# Altium project MotorBoard.PrjPcb
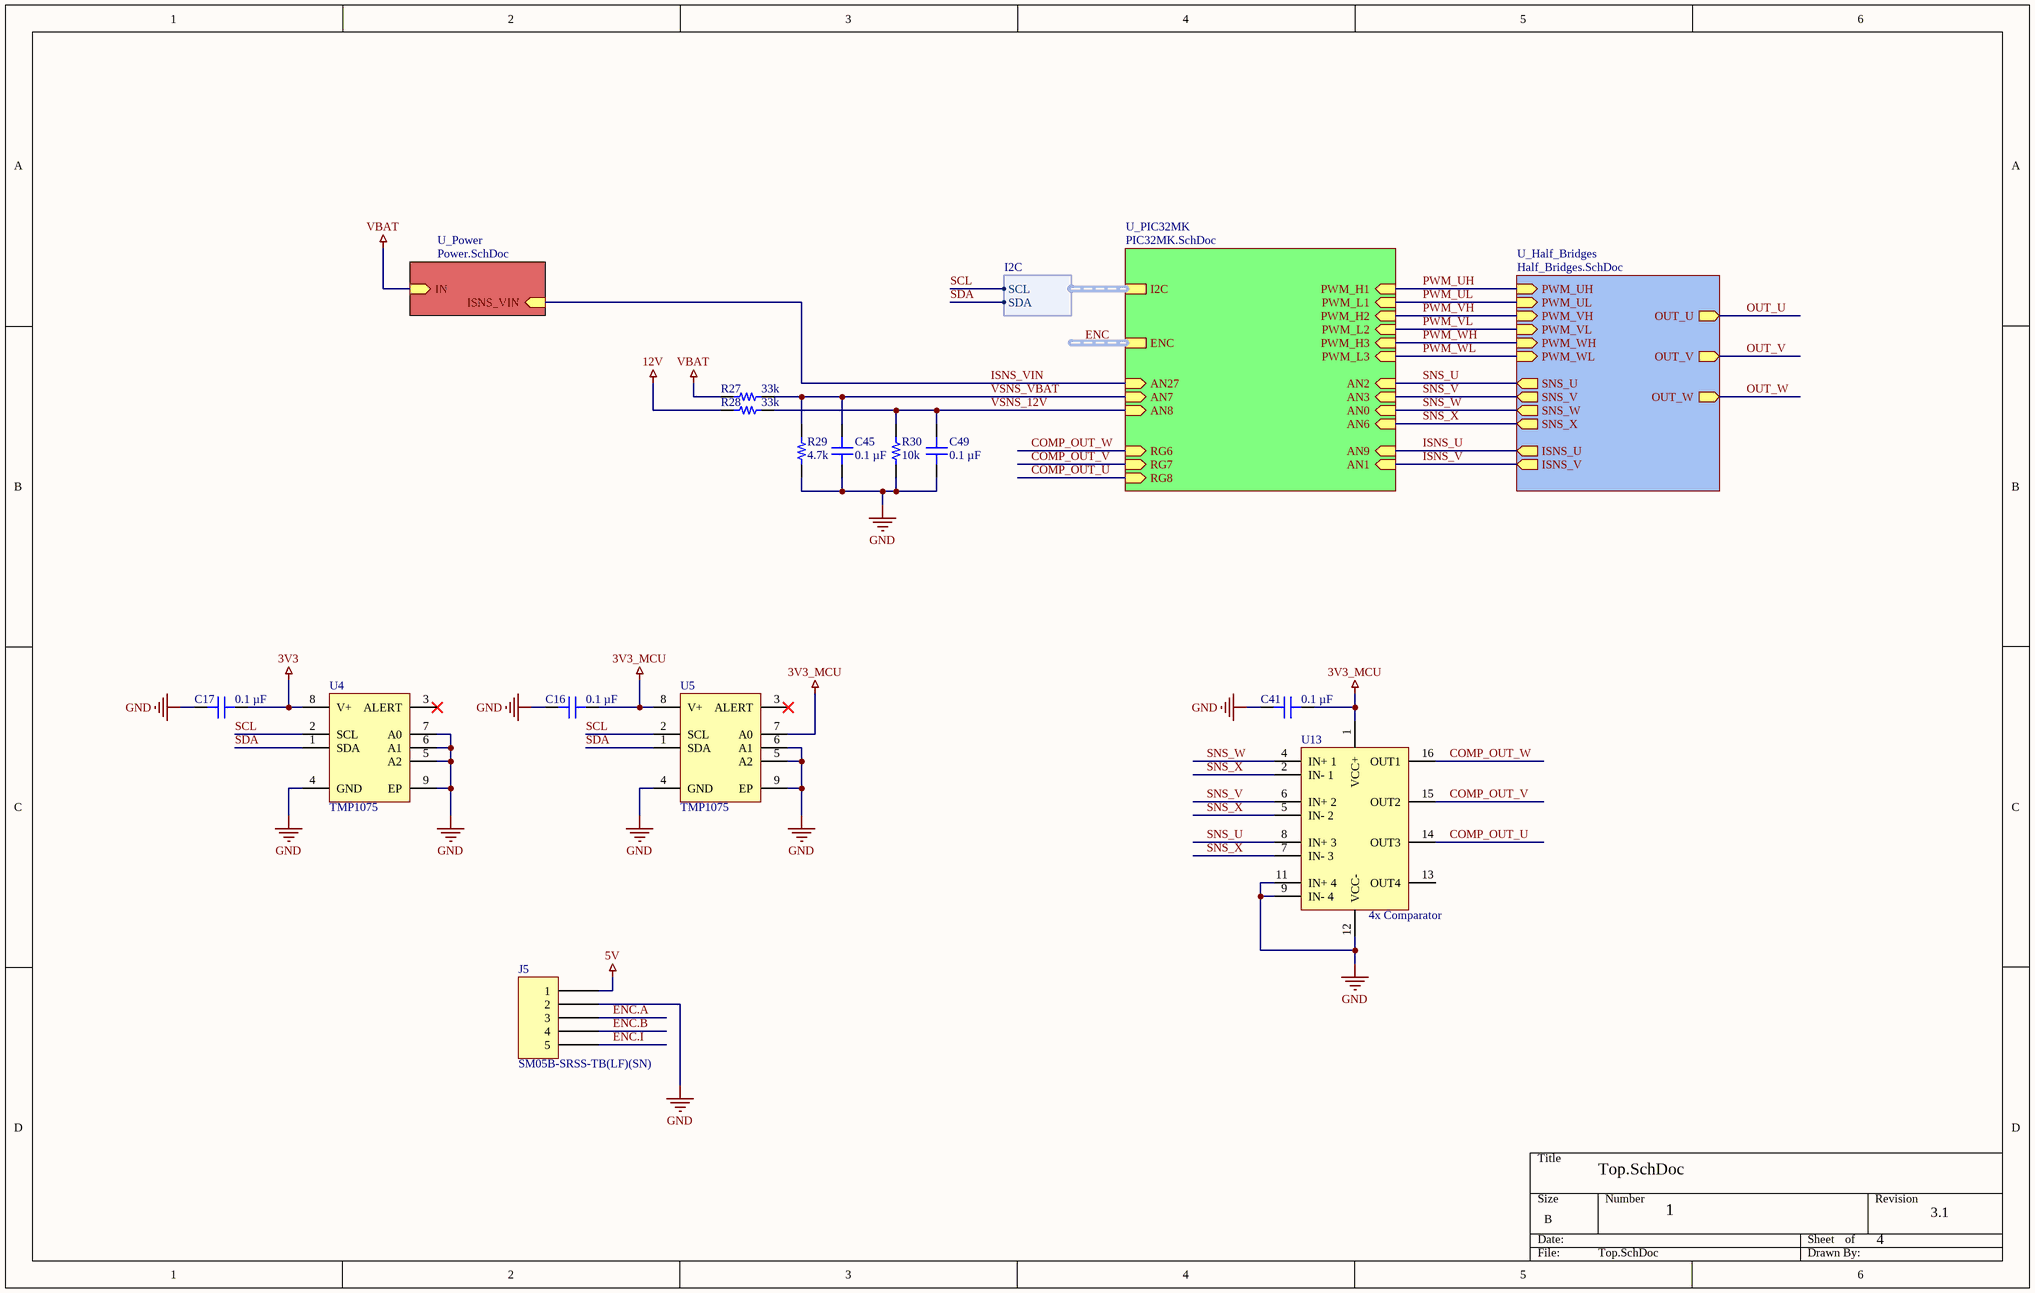
[diagram p0: Top.SchDoc]
Project: Cubli; ProjectRevision: 3.1
4 sheets, 119 parts. Net scope: hierarchical (ports join the sheet entries above them; power ports are global).
Board file: MotorBoard.PcbDoc
Sheets:
  Top.SchDoc
    U_PIC32MK = PIC32MK.SchDoc
    U_Power = Power.SchDoc
    U_Half_Bridges = Half_Bridges.SchDoc

## Sheet Top.SchDoc
size B; DocumentNumber: 5; Revision: 1.1; SheetNumber: 1; SheetTotal: 4

### Parts
C16  0.1 µF  [CAP 0402_1005]
C17  0.1 µF  [CAP 0402_1005]
C41  0.1 µF  [CAP 0402_1005]
C45  0.1 µF  [CAP 0402_1005]
C49  0.1 µF  [CAP 0402_1005]
J5  SM05B-SRSS-TB(LF)(SN)  [JST SM05B-SRSS-TB]
R27  33k  [RES 0402_1005]
R28  33k  [RES 0402_1005]
R29  4.7k  [RES 0402_1005]
R30  10k  [RES 0402_1005]
U4  TMP1075  [8_WSON_2x2_0.5mm]
U5  TMP1075  [8_WSON_2x2_0.5mm]
U13  4x Comparator  [QFN50P300X300X100-16N]

### Sub-sheets
U_Half_Bridges = Half_Bridges.SchDoc: PWM_UH (in), PWM_UL (in), PWM_VH (in), PWM_VL (in), PWM_WH (in), PWM_WL (in), SNS_U (out), SNS_V (out), SNS_W (out), SNS_X (out), OUT_U (out), OUT_V (out), OUT_W (out), ISNS_U (out), ISNS_V (out)
U_PIC32MK = PIC32MK.SchDoc: I2C (harness I2C), PWM_L1 (in), PWM_H1 (in), PWM_L2 (in), PWM_H2 (in), PWM_L3 (in), PWM_H3 (in), ENC (harness ENC), AN9 (in), AN1 (in), AN6 (in), AN2 (in), AN3 (in), AN0 (in), RG6 (in), RG7 (in), RG8 (in), AN7 (in), AN8 (in), AN27 (in)
U_Power = Power.SchDoc: IN (in), ISNS_VIN (in)

### Harnesses
I2C: SCL, SDA

### Nets
3V3: C17.2 U4.8(V+)
3V3_MCU: C16.2 C41.2 U5.7(A0) U5.8(V+) U13.1(VCC+)
5V: J5.1
12V: R28.2
GND: C16.1 C17.1 C41.1 C45.1 C49.1 J5.2 R29.2 R30.2 U4.4(GND) U4.5(A2) U4.6(A1) U4.7(A0) U4.9(EP) U5.4(GND) U5.5(A2) U5.6(A1) U5.9(EP) U13.9(IN-_4) U13.11(IN+_4) U13.12(VCC-)
VBAT: R27.2 ; sheet U_Power/IN
COMP_OUT_U: U13.14(OUT3) ; sheet U_PIC32MK/RG8
COMP_OUT_V: U13.15(OUT2) ; sheet U_PIC32MK/RG7
COMP_OUT_W: U13.16(OUT1) ; sheet U_PIC32MK/RG6
ENC.A: J5.3
ENC.B: J5.4
ENC.I: J5.5
ISNS_U: sheet U_PIC32MK/AN9, sheet U_Half_Bridges/ISNS_U
ISNS_V: sheet U_PIC32MK/AN1, sheet U_Half_Bridges/ISNS_V
ISNS_VIN: sheet U_PIC32MK/AN27, sheet U_Power/ISNS_VIN
PWM_UH: sheet U_PIC32MK/PWM_H1, sheet U_Half_Bridges/PWM_UH
PWM_UL: sheet U_PIC32MK/PWM_L1, sheet U_Half_Bridges/PWM_UL
PWM_VH: sheet U_PIC32MK/PWM_H2, sheet U_Half_Bridges/PWM_VH
PWM_VL: sheet U_PIC32MK/PWM_L2, sheet U_Half_Bridges/PWM_VL
PWM_WH: sheet U_PIC32MK/PWM_H3, sheet U_Half_Bridges/PWM_WH
PWM_WL: sheet U_PIC32MK/PWM_L3, sheet U_Half_Bridges/PWM_WL
SCL: U4.2(SCL) U5.2(SCL) ; sheet U_PIC32MK/I2C.SCL
SDA: U4.1(SDA) U5.1(SDA) ; sheet U_PIC32MK/I2C.SDA
SNS_U: U13.8(IN+_3) ; sheet U_PIC32MK/AN2, sheet U_Half_Bridges/SNS_U
SNS_V: U13.6(IN+_2) ; sheet U_PIC32MK/AN3, sheet U_Half_Bridges/SNS_V
SNS_W: U13.4(IN+_1) ; sheet U_PIC32MK/AN0, sheet U_Half_Bridges/SNS_W
SNS_X: U13.2(IN-_1) U13.5(IN-_2) U13.7(IN-_3) ; sheet U_PIC32MK/AN6, sheet U_Half_Bridges/SNS_X
VSNS_12V: C49.2 R28.1 R30.1 ; sheet U_PIC32MK/AN8
VSNS_VBAT: C45.2 R27.1 R29.1 ; sheet U_PIC32MK/AN7

Not connected (* = marked no-connect by the designer): U4 3(ALERT)*; U5 3(ALERT)*; U13 13(OUT4)

### Buses and harness runs
harness ENC = sheet U_PIC32MK/ENC

### Library data of the parts
C16 C17 C41 C45 C49 = C0402C104K4RACAUTO: CAP CER 0.1UF 16V X7R 0402; manufacturer: KEMET; Tolerance: ±10%; Part Number: C0402C104K4RACAUTO; Value: 0.1 µF; Applications: Automotive, Bypass, Decoupling; Capacitance: 0.1 µF; componentlink1description: Datasheet; componentlink1url: https://api.kemet.com/component-edge/download/specsheet/C0402C104K4RACAUTO.pdf; componentlink2description: DigiKey Link; componentlink2url: https://www.digikey.com/en/products/detail/kemet/C0402C104K4RACAUTO/3314827; Device Package: 0402 (1005 Metric); lastupdated: 8/14/2022 9:05:51 PM; Lifecycle Status: Active; Minimum Order: 1; Mounting Type: Surface Mount, MLCC; Operating Temperature: -55°C ~ 125°C; Package / Case: 0402 (1005 Metric); packaging: TapeAndReel; partid: 3024; Part Status: Active; price: 0.01; Ratings: AEC-Q200; series: SMD Auto X7R; Size / Dimension: 0.039" L x 0.020" W (1.00mm x 0.50mm); Supplier 1: DigiKey; Supplier Part Number 1: 399-6828-1-ND; Temperature Coefficient: X7R; Thickness (Max): 0.022" (0.55mm); Voltage - Rated: 16V
J5 = SM05B-SRSS-TB(LF)(SN): CONN HEADER SMD R/A 5POS 1MM; Manufacturer: JST Sales America Inc.; Current Rating (Amps): 0.7A; Material Flammability Rating: UL94 V-0; Number of Positions: 5; Number of Positions Loaded: All; Pitch - Mating: 0.039" (1.00mm); Shrouding: Shrouded - 4 Wall; Style: Board to Cable/Wire; Voltage Rating: 50V; Part Number: SM05B-SRSS-TB(LF)(SN); ComponentLink1Description: Datasheet; ComponentLink1URL: http://www.jst-mfg.com/product/pdf/eng/eSH.pdf; ComponentLink2Description: DigiKey Link; ComponentLink2URL: http://digikey.com/product-detail/en/jst-sales-america-inc/SM05B-SRSS-TB-LF-SN/455-1805-1-ND/926876; Connector Type: Header; Contact Finish - Mating: Tin; Contact Finish - Post: Tin; Contact Material: Copper Alloy; Contact Shape: Square; Contact Type: Male Pin; Fastening Type: Push-Pull; Features: Solder Retention; Insulation Color: Natural; Insulation Height: 0.114" (2.90mm); Insulation Material: Polyamide (PA), Nylon; LastUpdated: 1/12/2020 11:42:04 PM; Lifecycle Status: Active; Minimum Order: 1; Mounting Type: Surface Mount, Right Angle; Number of Rows: 1; Operating Temperature: -25°C ~ 85°C; Packaging: TapeAndReel; PartId: 63; Part Status: Active; Price: 0.32; Series: SR; Supplier 1: DigiKey; Supplier Part Number 1: 455-1805-1-ND; Termination: Solder
R27-R30 = RK73H1ETTP1432F: RES 14.3K OHM 1% 1/10W 0402; Manufacturer: KOA Speer Electronics, Inc.; Power (Watts): 0.1W, 1/10W; Resistance: 14.3 kOhms; Temperature Coefficient: ±100ppm/°C; Part Number: RK73H1ETTP1432F; ComponentLink1Description: Datasheet; ComponentLink1URL: http://www.koaspeer.com/catimages/Products/RK73H/RK73H.pdf; ComponentLink2Description: DigiKey Link; ComponentLink2URL: https://www.digikey.com/en/products/detail/koa-speer-electronics-inc/RK73H1ETTP1432F/9844351; Composition: Thick Film; Device Package: 0402 (1005 Metric); Features: Automotive AEC-Q200, Moisture Resistant; Height - Seated (Max): 0.016" (0.40mm); LastUpdated: 8/14/2022 9:23:49 PM; Lifecycle Status: Active; Minimum Order: 1; Number of Terminations: 2; Operating Temperature: -55°C ~ 155°C; Package / Case: 0402 (1005 Metric); Packaging: CutTape; PartId: 10193; Part Status: Active; Price: 0.01; Ratings: AEC-Q200; Series: RK73H; Size / Dimension: 0.039" L x 0.020" W (1.00mm x 0.50mm); Supplier 1: DigiKey; Supplier Part Number 1: 2019-RK73H1ETTP1432FCT-ND; Supplier Device Package: 0402; Tolerance: ±1%
  R27 R28: Value: 33k
  R29: Value: 4.7k
  R30: Value: 10k
U4 U5 = TMP1075: I2C TEMP SENSOR
U13 = LM2901Q4T: Comparator General Purpose CMOS, DTL, MOS, Open-Collector, TTL 16-QFN (3x3)

## Sheet PIC32MK.SchDoc
size B; DocumentNumber: 3; SheetNumber: 2; SheetTotal: 4
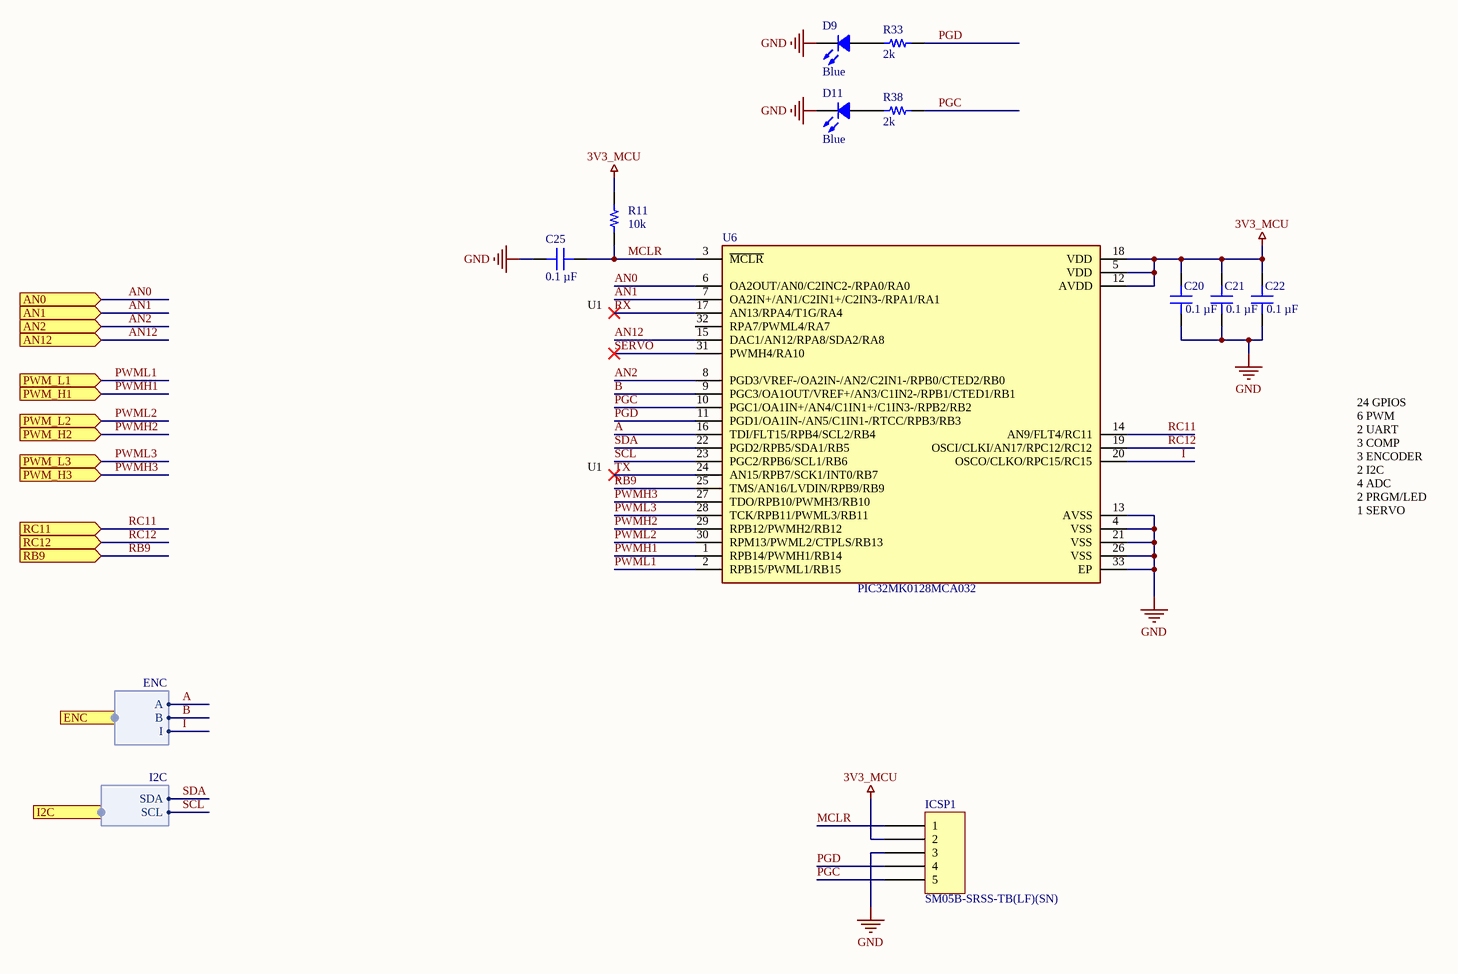
[diagram p1: PIC32MK.SchDoc]

### Parts
C20  0.1 µF  [CAP 0402_1005]
C21  0.1 µF  [CAP 0402_1005]
C22  0.1 µF  [CAP 0402_1005]
C25  0.1 µF  [CAP 0402_1005]
D9  Blue  [LED 0603_1608 GREEN]
D11  Blue  [LED 0603_1608 GREEN]
ICSP1  SM05B-SRSS-TB(LF)(SN)  [JST SM05B-SRSS-TB]
R11  10k  [RES 0402_1005]
R33  2k  [RES 0402_1005]
R38  2k  [RES 0402_1005]
U6  PIC32MK0128MCA032  [32-QFN_5x5_PIC32]

### Ports
AN0 (in), AN1 (in), AN2 (in), AN12 (in), ENC (harness ENC), I2C (harness I2C), PWM_H1 (in), PWM_H2 (in), PWM_H3 (in), PWM_L1 (in), PWM_L2 (in), PWM_L3 (in), RB9 (in), RC11 (in), RC12 (in)

### Harnesses
I2C: SDA, SCL
ENC: A, B, I

### Nets
3V3_MCU: C20.2 C21.2 C22.2 ICSP1.2 R11.2 U6.5(VDD) U6.12(AVDD) U6.18(VDD)
GND: C20.1 C21.1 C22.1 C25.2 D9.2 D11.2 ICSP1.3 U6.4(VSS) U6.13(AVSS) U6.21(VSS) U6.26(VSS) U6.33(EP)
A: U6.16(TDI/FLT15/RPB4/SCL2/RB4) ; port ENC.A  [project net ENC.A]
AN0: U6.6(OA2OUT/AN0/C2INC2-/RPA0/RA0) ; port AN0  [project net SNS_W]
AN1: U6.7(OA2IN+/AN1/C2IN1+/C2IN3-/RPA1/RA1) ; port AN1  [project net ISNS_V]
AN2: U6.8(PGD3/VREF-/OA2IN-/AN2/C2IN1-/RPB0/CTED2/RB0) ; port AN2  [project net SNS_U]
AN12: U6.15(DAC1/AN12/RPA8/SDA2/RA8) ; port AN12
B: U6.9(PGC3/OA1OUT/VREF+/AN3/C1IN2-/RPB1/CTED1/RB1) ; port ENC.B  [project net ENC.B]
I: U6.20(OSCO/CLKO/RPC15/RC15) ; port ENC.I  [project net ENC.I]
MCLR: C25.1 ICSP1.1 R11.1 U6.3(~{MCLR})
PGC: ICSP1.5 R38.1 U6.10(PGC1/OA1IN+/AN4/C1IN1+/C1IN3-/RPB2/RB2)
PGD: ICSP1.4 R33.1 U6.11(PGD1/OA1IN-/AN5/C1IN1-/RTCC/RPB3/RB3)
PWMH1: U6.1(RPB14/PWMH1/RB14) ; port PWM_H1  [project net PWM_UH]
PWMH2: U6.29(RPB12/PWMH2/RB12) ; port PWM_H2  [project net PWM_VH]
PWMH3: U6.27(TDO/RPB10/PWMH3/RB10) ; port PWM_H3  [project net PWM_WH]
PWML1: U6.2(RPB15/PWML1/RB15) ; port PWM_L1  [project net PWM_UL]
PWML2: U6.30(RPM13/PWML2/CTPLS/RB13) ; port PWM_L2  [project net PWM_VL]
PWML3: U6.28(TCK/RPB11/PWML3/RB11) ; port PWM_L3  [project net PWM_WL]
RB9: U6.25(TMS/AN16/LVDIN/RPB9/RB9) ; port RB9
RC11: U6.14(AN9/FLT4/RC11) ; port RC11
RC12: U6.19(OSCI/CLKI/AN17/RPC12/RC12) ; port RC12
RX: U6.17(AN13/RPA4/T1G/RA4)
SCL: U6.23(PGC2/RPB6/SCL1/RB6) ; port I2C.SCL
SDA: U6.22(PGD2/RPB5/SDA1/RB5) ; port I2C.SDA
SERVO: U6.31(PWMH4/RA10)
TX: U6.24(AN15/RPB7/SCK1/INT0/RB7)
NetD9_1: D9.1 R33.2
NetD11_1: D11.1 R38.2

Not connected (* = marked no-connect by the designer): U6 32(RPA7/PWML4/RA7)

### Notes on the sheet
- (near C25) U1
- U1
- 24 GPIOS
  6 PWM
  2 UART
  3 COMP
  3 ENCODER
  2 I2C
  4 ADC
  2 PRGM/LED
  1 SERVO

### Library data of the parts
C20-C22 C25 = C0402C104K4RACAUTO: as C16 on sheet Top; Part Number: C0402C104K4RACAUTO; Value: 0.1 µF; Applications: Automotive, Bypass, Decoupling; Capacitance: 0.1 µF; componentlink1description: Datasheet; componentlink1url: https://api.kemet.com/component-edge/download/specsheet/C0402C104K4RACAUTO.pdf; componentlink2description: DigiKey Link; componentlink2url: https://www.digikey.com/en/products/detail/kemet/C0402C104K4RACAUTO/3314827; Device Package: 0402 (1005 Metric); lastupdated: 8/14/2022 9:05:51 PM; Lifecycle Status: Active; Minimum Order: 1; Mounting Type: Surface Mount, MLCC; Operating Temperature: -55°C ~ 125°C; Package / Case: 0402 (1005 Metric); packaging: TapeAndReel; partid: 3024; Part Status: Active; price: 0.01; Ratings: AEC-Q200; series: SMD Auto X7R; Size / Dimension: 0.039" L x 0.020" W (1.00mm x 0.50mm); Supplier 1: DigiKey; Supplier Part Number 1: 399-6828-1-ND; Temperature Coefficient: X7R; Thickness (Max): 0.022" (0.55mm); Voltage - Rated: 16V
D9 D11 = XZCDGK53W-8VF: Blue LED; Manufacturer: SunLED; Color: Green; Configuration: Independent; Current - Test: 2mA; Lens Color: Colorless; Lens Size: 0.35mm Dia; Lens Style: Round with Domed Top; Lens Transparency: Clear; Millicandela Rating: 417mcd; Value: Green; Viewing Angle: 60°; Voltage - Forward (Vf) (Typ): 2.65V; Wavelength - Dominant: 525nm; Wavelength - Peak: 515nm; Part Number: XZCDGK53W-8VF; ComponentLink1Description: Datasheet; ComponentLink1URL: https://www.sunledusa.com/products/spec/XZCDGK53W-8VF.pdf; ComponentLink2Description: DigiKey Link; ComponentLink2URL: http://digikey.com/product-detail/en/sunled/XZCDGK53W-8VF/1497-XZCDGK53W-8VFCT-ND/10449792; Device Package: 0603 (1608 Metric); Height (Max): 1.10mm; LastUpdated: 21-Jan-20 3:12:09 AM; Lifecycle Status: Active; Minimum Order: 1; Mounting Type: Surface Mount; Package / Case: 0603 (1608 Metric); Packaging: Unknown; PartId: 938; Part Status: Active; Price: 0.18; Series: Ultra Low Current; Size / Dimension: 1.60mm L x 0.80mm W; Supplier 1: DigiKey; Supplier Part Number 1: 1497-XZCDGK53W-8VFCT-ND; Supplier Device Package: 2-SMD
ICSP1 = SM05B-SRSS-TB(LF)(SN): as J5 on sheet Top; Part Number: SM05B-SRSS-TB(LF)(SN); ComponentLink1Description: Datasheet; ComponentLink1URL: http://www.jst-mfg.com/product/pdf/eng/eSH.pdf; ComponentLink2Description: DigiKey Link; ComponentLink2URL: http://digikey.com/product-detail/en/jst-sales-america-inc/SM05B-SRSS-TB-LF-SN/455-1805-1-ND/926876; Connector Type: Header; Contact Finish - Mating: Tin; Contact Finish - Post: Tin; Contact Material: Copper Alloy; Contact Shape: Square; Contact Type: Male Pin; Fastening Type: Push-Pull; Features: Solder Retention; Insulation Color: Natural; Insulation Height: 0.114" (2.90mm); Insulation Material: Polyamide (PA), Nylon; LastUpdated: 1/12/2020 11:42:04 PM; Lifecycle Status: Active; Minimum Order: 1; Mounting Type: Surface Mount, Right Angle; Number of Rows: 1; Operating Temperature: -25°C ~ 85°C; Packaging: TapeAndReel; PartId: 63; Part Status: Active; Price: 0.32; Series: SR; Supplier 1: DigiKey; Supplier Part Number 1: 455-1805-1-ND; Termination: Solder
R11 R33 R38 = RK73H1ETTP1432F: as R27 on sheet Top; Part Number: RK73H1ETTP1432F; ComponentLink1Description: Datasheet; ComponentLink1URL: http://www.koaspeer.com/catimages/Products/RK73H/RK73H.pdf; ComponentLink2Description: DigiKey Link; ComponentLink2URL: https://www.digikey.com/en/products/detail/koa-speer-electronics-inc/RK73H1ETTP1432F/9844351; Composition: Thick Film; Device Package: 0402 (1005 Metric); Features: Automotive AEC-Q200, Moisture Resistant; Height - Seated (Max): 0.016" (0.40mm); LastUpdated: 8/14/2022 9:23:49 PM; Lifecycle Status: Active; Minimum Order: 1; Number of Terminations: 2; Operating Temperature: -55°C ~ 155°C; Package / Case: 0402 (1005 Metric); Packaging: CutTape; PartId: 10193; Part Status: Active; Price: 0.01; Ratings: AEC-Q200; Series: RK73H; Size / Dimension: 0.039" L x 0.020" W (1.00mm x 0.50mm); Supplier 1: DigiKey; Supplier Part Number 1: 2019-RK73H1ETTP1432FCT-ND; Supplier Device Package: 0402; Tolerance: ±1%
  R11: Value: 10k
  R33 R38: Value: 2k
U6 = PIC32MK0128MCA032: PIC32MK Microcontroller IC 32-Bit 120MHz 1MB _1M x 8_ FLASH 32-VQFN_5x5_; MP: PIC32MK1024MCF064-I/PT; MF: Microchip; Digi-Key_Purchase_URL: https://www.digikey.kr/product-detail/en/microchip-technology/PIC32MK1024MCF064-I-PT/PIC32MK1024MCF064-I-PT-ND/7164902?utm_source=snapeda&utm_medium=aggregator&utm_campaign=symbol; Package: TQFP-64 Microchip; Digi-Key_Part_Number: PIC32MK1024MCF064-I/PT-ND; Value: *; SnapEDA_Link: https://www.snapeda.com/parts/PIC32MK1024MCF064-I/PT/Microchip/view-part/876704/?ref=snap

## Sheet Power.SchDoc
size B; DocumentNumber: 4; SheetNumber: 3; SheetTotal: 4
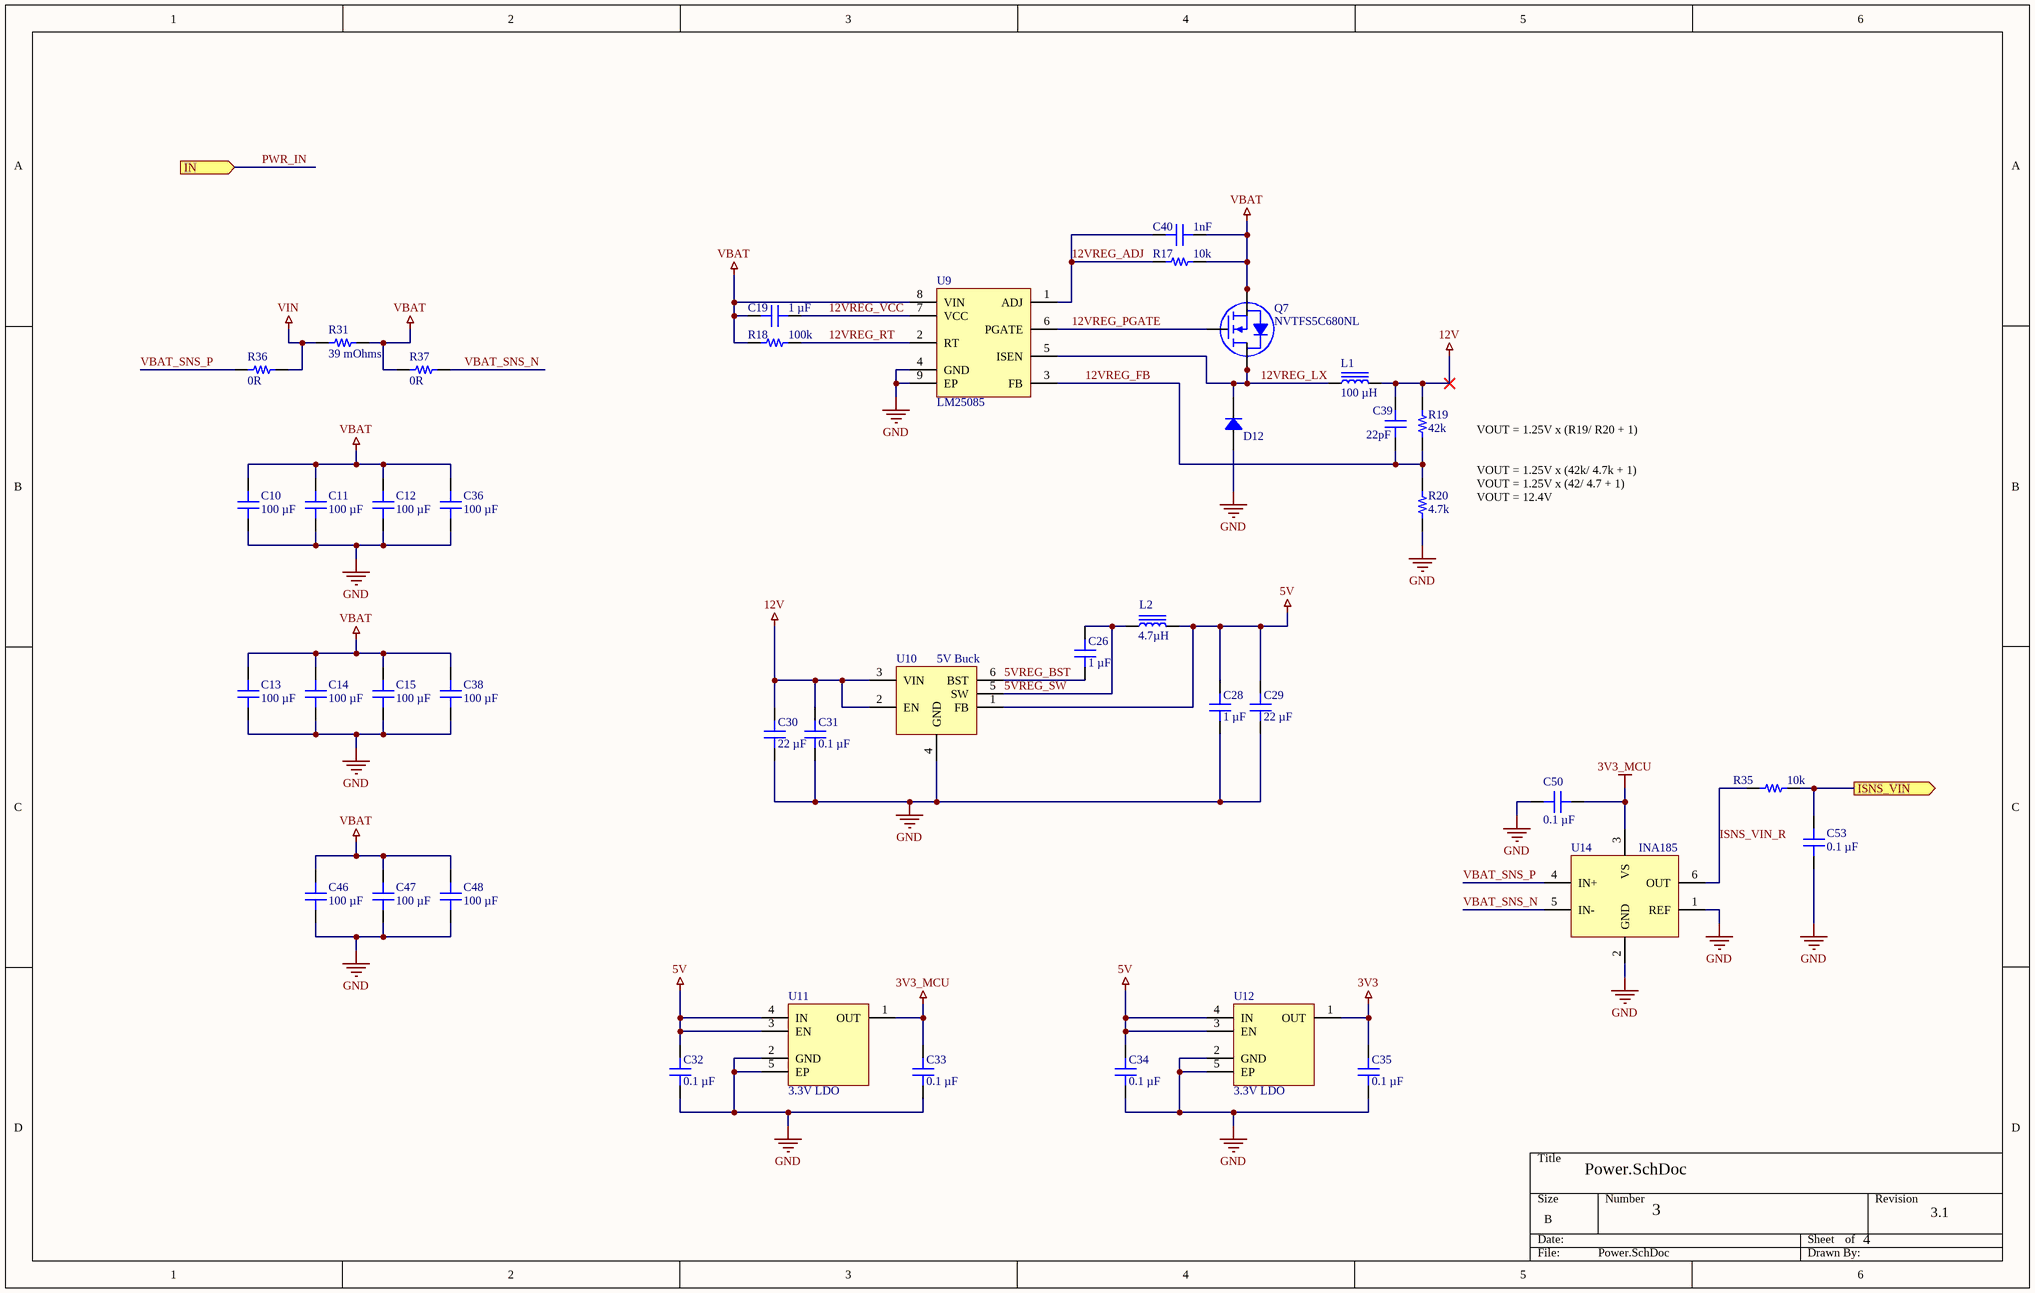
[diagram p2: Power.SchDoc]

### Parts
C10  100 µF  [CAP 1210_3225 - 1MM]
C11  100 µF  [CAP 1210_3225 - 1MM]
C12  100 µF  [CAP 1210_3225 - 1MM]
C13  100 µF  [CAP 1210_3225 - 1MM]
C14  100 µF  [CAP 1210_3225 - 1MM]
C15  100 µF  [CAP 1210_3225 - 1MM]
C19  1 µF  [CAP 0402_1005]
C26  1 µF  [CAP 0402_1005]
C28  1 µF  [CAP 0402_1005]
C29  22 µF  [CAP 0402_1005]
C30  22 µF  [CAP 0603_1608]
C31  0.1 µF  [CAP 0402_1005]
C32  0.1 µF  [CAP 0402_1005]
C33  0.1 µF  [CAP 0402_1005]
C34  0.1 µF  [CAP 0402_1005]
C35  0.1 µF  [CAP 0402_1005]
C36  100 µF  [CAP 1210_3225 - 1MM]
C38  100 µF  [CAP 1210_3225 - 1MM]
C39  22pF  [CAP 0402_1005]
C40  1nF  [CAP 0402_1005]
C46  100 µF  [CAP 1210_3225 - 1MM]
C47  100 µF  [CAP 1210_3225 - 1MM]
C48  100 µF  [CAP 1210_3225 - 1MM]
C50  0.1 µF  [CAP 0402_1005]
C53  0.1 µF  [CAP 0402_1005]
D12  SE10FGHM3/H  [SMF DO-219AB]  (value not drawn)
L1  100 µH  [TDK VLCF4028-2]
L2  4.7µH  [IND 1008_2520]
Q7  NVTFS5C680NL  [NVTFS015N04CTAG]
R17  10k  [RES 0402_1005]
R18  100k  [RES 0402_1005]
R19  42k  [RES 0402_1005]
R20  4.7k  [RES 0402_1005]
R31  39 mOhms  [RES 1206_3216]
R35  10k  [RES 0402_1005]
R36  0R  [RES 0201_0603]
R37  0R  [RES 0201_0603]
U9  LM25085  [8_WSON_3x3_0.5mm]
U10  5V Buck  [TSOT-26-6 - 3.2mm]
U11  3.3V LDO  [XDFN-4]
U12  3.3V LDO  [XDFN-4]
U14  INA185  [TI SC70-6 DCK]

### Ports
IN (in), ISNS_VIN (out)

### Nets
3V3: C35.2 U12.1(OUT)
3V3_MCU: C33.2 C50.1 U11.1(OUT) U14.3(VS)
5V: C28.2 C29.2 C32.2 C34.2 L2.2 U10.1(FB) U11.3(EN) U11.4(IN) U12.3(EN) U12.4(IN)
12V: C30.2 C31.2 C39.2 L1.2 R19.2 U10.2(EN) U10.3(VIN)
GND: C10.1 C11.1 C12.1 C13.1 C14.1 C15.1 C28.1 C29.1 C30.1 C31.1 C32.1 C33.1 C34.1 C35.1 C36.1 C38.1 C46.1 C47.1 C48.1 C50.2 C53.2 D12.1 R20.1 U9.4(GND) U9.9(EP) U10.4(GND) U11.2(GND) U11.5(EP) U12.2(GND) U12.5(EP) U14.1(REF) U14.2(GND)
VBAT: C10.2 C11.2 C12.2 C13.2 C14.2 C15.2 C19.1 C36.2 C38.2 C40.2 C46.2 C47.2 C48.2 Q7.1(S) Q7.2(S) Q7.3(S) R17.2 R18.1 R31.2 R37.1 U9.8(VIN) ; port IN  [also labelled PWR_IN]
VIN: R31.1 R36.2
5VREG_BST: C26.1 U10.6(BST)
5VREG_SW: C26.2 L2.1 U10.5(SW)
12VREG_ADJ: C40.1 R17.1 U9.1(ADJ)
12VREG_FB: C39.1 R19.1 R20.2 U9.3(FB)
12VREG_LX: D12.2 L1.1 Q7.5(D) Q7.6(D) Q7.7(D) Q7.8(D) U9.5(ISEN)
12VREG_PGATE: Q7.4(G) U9.6(PGATE)
12VREG_RT: R18.2 U9.2(RT)
12VREG_VCC: C19.2 U9.7(VCC)
ISNS_VIN: C53.1 R35.2 ; port ISNS_VIN
ISNS_VIN_R: R35.1 U14.6(OUT)
VBAT_SNS_N: R37.2 U14.5(IN-)
VBAT_SNS_P: R36.1 U14.4(IN+)

### Notes on the sheet
- VOUT = 1.25V x (R19/ R20 + 1)
- VOUT = 1.25V x (42k/ 4.7k + 1)
  VOUT = 1.25V x (42/ 4.7 + 1)
  VOUT = 12.4V

### Library data of the parts
C10-C15 C36 C38 C46-C48 = MSASE32MAB5107MPNA01: CAP CER 100UF 16V X5R 1210; manufacturer: Taiyo Yuden; Tolerance: ±20%; Part Number: MSASE32MAB5107MPNA01; Value: 100 µF; Applications: SMPS Filtering; Capacitance: 100 µF; componentlink1description: Datasheet; componentlink1url: https://mm.digikey.com/Volume0/opasdata/d220001/medias/docus/5731/MSR01_e.pdf; componentlink2description: DigiKey Link; componentlink2url: https://www.digikey.com/en/products/detail/taiyo-yuden/MSASE32MAB5107MPNA01/16664685; Device Package: 1210 (3225 Metric); lastupdated: 6/4/2024 7:20:42 PM; Lifecycle Status: Active; Minimum Order: 1; Mounting Type: Surface Mount, MLCC; Operating Temperature: -55°C ~ 85°C; Package / Case: 1210 (3225 Metric); packaging: TapeAndReel; partid: 58478; price: 0.66; series: MSAS; Size / Dimension: 0.126" L x 0.098" W (3.20mm x 2.50mm); Supplier 1: DigiKey; Supplier Part Number 1: 587-MSASE32MAB5107MPNA01CT-ND; Temperature Coefficient: X5R; Thickness (Max): 0.110" (2.80mm); Voltage - Rated: 16V
C19 C26 C28 C29 C39 C40 = C0402C104K4RACAUTO: CAP CER 0.1UF 16V X7R 0402; manufacturer: KEMET; Capacitance: 0.1 µF; Tolerance: ±10%; Part Number: C0402C104K4RACAUTO; Applications: Automotive, Bypass, Decoupling; componentlink1description: Datasheet; componentlink1url: https://api.kemet.com/component-edge/download/specsheet/C0402C104K4RACAUTO.pdf; componentlink2description: DigiKey Link; componentlink2url: https://www.digikey.com/en/products/detail/kemet/C0402C104K4RACAUTO/3314827; Device Package: 0402 (1005 Metric); lastupdated: 8/14/2022 9:05:51 PM; Lifecycle Status: Active; Minimum Order: 1; Mounting Type: Surface Mount, MLCC; Operating Temperature: -55°C ~ 125°C; Package / Case: 0402 (1005 Metric); packaging: TapeAndReel; partid: 3024; Part Status: Active; price: 0.01; Ratings: AEC-Q200; series: SMD Auto X7R; Size / Dimension: 0.039" L x 0.020" W (1.00mm x 0.50mm); Supplier 1: DigiKey; Supplier Part Number 1: 399-6828-1-ND; Temperature Coefficient: X7R; Thickness (Max): 0.022" (0.55mm); Voltage - Rated: 16V
  C19 C26 C28: Value: 1 µF
  C29: Value: 22 µF
  C39: Value: 22pF
  C40: Value: 1nF
C30 = C0603B476M007T: CAP CER 47UF 6.3V X5R 0603; manufacturer: Holy Stone Enterprise Co., Ltd.; Capacitance: 47 µF; Tolerance: ±20%; Part Number: C0603B476M007T; Value: 22 µF; Applications: SMPS Filtering; componentlink1description: Datasheet; componentlink1url: https://media.digikey.com/pdf/Data%20Sheets/Holy%20Stone/HCC_Series_DS.pdf; componentlink2description: DigiKey Link; componentlink2url: https://www.digikey.com/en/products/detail/holy-stone-enterprise-co-ltd/C0603B476M007T/16895203; Device Package: 0603 (1608 Metric); lastupdated: 2/9/2024 8:09:41 PM; Lifecycle Status: Active; Minimum Order: 1; Mounting Type: Surface Mount, MLCC; Operating Temperature: -55°C ~ 85°C; Package / Case: 0603 (1608 Metric); packaging: TapeAndReel; partid: 48531; Part Status: Active; price: 0.12; series: HCC; Size / Dimension: 0.063" L x 0.031" W (1.60mm x 0.80mm); Supplier 1: DigiKey; Supplier Part Number 1: 4587-C0603B476M007TCT-ND; Temperature Coefficient: X5R; Thickness (Max): 0.039" (1.00mm); Voltage - Rated: 6.3V
C31-C35 C50 C53 = C0402C104K4RACAUTO: as C16 on sheet Top; Part Number: C0402C104K4RACAUTO; Value: 0.1 µF; Applications: Automotive, Bypass, Decoupling; Capacitance: 0.1 µF; componentlink1description: Datasheet; componentlink1url: https://api.kemet.com/component-edge/download/specsheet/C0402C104K4RACAUTO.pdf; componentlink2description: DigiKey Link; componentlink2url: https://www.digikey.com/en/products/detail/kemet/C0402C104K4RACAUTO/3314827; Device Package: 0402 (1005 Metric); lastupdated: 8/14/2022 9:05:51 PM; Lifecycle Status: Active; Minimum Order: 1; Mounting Type: Surface Mount, MLCC; Operating Temperature: -55°C ~ 125°C; Package / Case: 0402 (1005 Metric); packaging: TapeAndReel; partid: 3024; Part Status: Active; price: 0.01; Ratings: AEC-Q200; series: SMD Auto X7R; Size / Dimension: 0.039" L x 0.020" W (1.00mm x 0.50mm); Supplier 1: DigiKey; Supplier Part Number 1: 399-6828-1-ND; Temperature Coefficient: X7R; Thickness (Max): 0.022" (0.55mm); Voltage - Rated: 16V
D12 = SE10FGHM3/H: DIODE GEN PURP 400V 1A DO219AB; Manufacturer: Vishay Semiconductor Diodes Division; Capacitance @ Vr, F: 7.5pF @ 4V, 1MHz; Current - Reverse Leakage @ Vr: 5µA @ 400V; Diode Type: Standard; Reverse Recovery Time (trr): 780ns; Speed: Standard Recovery >500ns, > 200mA (Io); Voltage - Forward (Vf) (Max) @ If: 1.05V @ 1A; Part Number: SE10FGHM3/H; ComponentLink1Description: Datasheet; ComponentLink1URL: http://www.vishay.com/docs/87722/se10fd-se10fg-se10fj.pdf; ComponentLink2Description: DigiKey Link; ComponentLink2URL: http://digikey.com/product-detail/en/vishay-semiconductor-diodes-division/SE10FGHM3-H/SE10FGHM3-HGICT-ND/8565217; Current - Average Rectified (Io): 1A; LastUpdated: 6/3/2024 8:05:29 PM; Lifecycle Status: Active; Minimum Order: 1; Mounting Type: Surface Mount; Operating Temperature - Junction: -55°C ~ 175°C; Package / Case: DO-219AB; Packaging: TapeAndReel; PartId: 1227; Part Status: Active; Price: 0.10; Series: Automotive, AEC-Q101; Supplier 1: DigiKey; Supplier Part Number 1: SE10FGHM3/HGICT-ND; Supplier Device Package: DO-219AB (SMF); Voltage - DC Reverse (Vr) (Max): 400V
L1 = VLCF4028T-101MR33-2: FIXED IND 100UH 330MA 1 OHM SMD; Manufacturer: TDK Corporation; DC Resistance (DCR): 1Ohm Max; Inductance Frequency - Test: 100 kHz; Material - Core: Ferrite; Shielding: Shielded; Tolerance: ±20%; Type: Drum Core, Wirewound; Part Number: VLCF4028T-101MR33-2; ComponentLink1Description: Datasheet; ComponentLink1URL: https://product.tdk.com/info/en/catalog/datasheets/inductor_commercial_power_vlcf4028-2_en.pdf?ref_disty=digikey; ComponentLink2Description: DigiKey Link; ComponentLink2URL: https://www.digikey.com/en/products/detail/tdk-corporation/VLCF4028T-101MR33-2/2465299; Current Rating (Amps): 330 mA; Current - Saturation: 330mA; Device Package: Nonstandard; Height - Seated (Max): 0.110" (2.80mm); Inductance: 100 µH; LastUpdated: 6/3/2024 8:02:44 PM; Lifecycle Status: Active; Minimum Order: 1; Mounting Type: Surface Mount; Operating Temperature: -40°C ~ 105°C; Package / Case: Nonstandard; Packaging: TapeAndReel; PartId: 200; Part Status: Active; Price: 0.30; Series: VLCF; Size / Dimension: 0.157" L x 0.157" W (4.00mm x 4.00mm); Supplier 1: DigiKey; Supplier Part Number 1: 445-6542-1-ND; Value: 100 µH
L2 = MLP2520S4R7ST0S1: FIXED IND 4.7UH 1A 110 MOHM SMD; Manufacturer: TDK Corporation; DC Resistance (DCR): 143mOhm Max; Inductance Frequency - Test: 2MHz; Material - Core: Ferrite; Shielding: Shielded; Tolerance: ±20%; Type: Multilayer; Part Number: MLP2520S4R7ST0S1; ComponentLink1Description: Datasheet; ComponentLink1URL: https://product.tdk.com/info/en/catalog/datasheets/inductor_commercial_power_mlp2520_en.pdf?ref_disty=digikey; ComponentLink2Description: DigiKey Link; ComponentLink2URL: http://digikey.com/product-detail/en/tdk-corporation/MLP2520S4R7ST0S1/445-6378-1-ND/2465705; Current Rating (Amps): 1A; Device Package: 1008 (2520 Metric); Height - Seated (Max): 0.039" (1.00mm); Inductance: 4.7µH; LastUpdated: 13-Aug-20 11:03:40 AM; Lifecycle Status: Active; Minimum Order: 1; Mounting Type: Surface Mount; Operating Temperature: -40°C ~ 125°C; Package / Case: 1008 (2520 Metric); Packaging: TapeAndReel; PartId: 3467; Part Status: Active; Price: 0.14; Series: MLP; Size / Dimension: 0.098" L x 0.079" W (2.50mm x 2.00mm); Supplier 1: DigiKey; Supplier Part Number 1: 445-6378-1-ND; Supplier Device Package: 1008 (2520 Metric); Value: 4.7µH
Q7 = NVTFS5C680NL: N-FET
R17-R20 R35 = RK73H1ETTP1432F: as R27 on sheet Top; Part Number: RK73H1ETTP1432F; ComponentLink1Description: Datasheet; ComponentLink1URL: http://www.koaspeer.com/catimages/Products/RK73H/RK73H.pdf; ComponentLink2Description: DigiKey Link; ComponentLink2URL: https://www.digikey.com/en/products/detail/koa-speer-electronics-inc/RK73H1ETTP1432F/9844351; Composition: Thick Film; Device Package: 0402 (1005 Metric); Features: Automotive AEC-Q200, Moisture Resistant; Height - Seated (Max): 0.016" (0.40mm); LastUpdated: 8/14/2022 9:23:49 PM; Lifecycle Status: Active; Minimum Order: 1; Number of Terminations: 2; Operating Temperature: -55°C ~ 155°C; Package / Case: 0402 (1005 Metric); Packaging: CutTape; PartId: 10193; Part Status: Active; Price: 0.01; Ratings: AEC-Q200; Series: RK73H; Size / Dimension: 0.039" L x 0.020" W (1.00mm x 0.50mm); Supplier 1: DigiKey; Supplier Part Number 1: 2019-RK73H1ETTP1432FCT-ND; Supplier Device Package: 0402; Tolerance: ±1%
  R17 R35: Value: 10k
  R18: Value: 100k
  R19: Value: 42k
  R20: Value: 4.7k
R31 = KRL1632E-M-R039-F-T5: RES 0.039 OHM 1% 3/4W 1206; Manufacturer: Susumu; Power (Watts): 0.75W, 3/4W; Temperature Coefficient: ±50ppm/°C; Part Number: KRL1632E-M-R039-F-T5; ComponentLink1Description: Datasheet; ComponentLink1URL: http://www.susumu.co.jp/common/pdf/n_catalog_partition09_en.pdf; ComponentLink2Description: DigiKey Link; ComponentLink2URL: https://www.digikey.com/en/products/detail/susumu/KRL1632E-M-R039-F-T5/3738003; Composition: Metal Foil; Device Package: 1206 (3216 Metric); Features: Automotive AEC-Q200, Current Sense; Height - Seated (Max): 0.028" (0.70mm); LastUpdated: 2/9/2024 8:54:46 PM; Lifecycle Status: Active; Minimum Order: 1; Number of Terminations: 2; Operating Temperature: -55°C ~ 155°C; Package / Case: 1206 (3216 Metric); Packaging: TapeAndReel; PartId: 26838; Part Status: Active; Price: 0.09; Ratings: AEC-Q200; Resistance: 39 mOhms; Series: KRL; Size / Dimension: 0.126" L x 0.063" W (3.20mm x 1.60mm); Supplier 1: DigiKey; Supplier Part Number 1: 408-1577-1-ND; Supplier Device Package: 1206; Tolerance: ±1%; Value: 39 mOhms
R36 R37 = CRG0201F10R: RES SMD 10 OHM 1% 1/20W 0201; Manufacturer: TE Connectivity Passive Product; Power (Watts): 0.05W, 1/20W; Resistance: 10 Ohms; Temperature Coefficient: ±400ppm/°C; Part Number: CRG0201F10R; Value: 0R; ComponentLink1Description: Datasheet; ComponentLink1URL: https://www.te.com/commerce/DocumentDelivery/DDEController?Action=srchrtrv&DocNm=1773204&DocType=DS&DocLang=English; ComponentLink2Description: DigiKey Link; ComponentLink2URL: https://www.digikey.com/en/products/detail/te-connectivity-passive-product/CRG0201F10R/4489648; Composition: Thick Film; Device Package: 0201 (0603 Metric); Height - Seated (Max): 0.010" (0.26mm); LastUpdated: 6/4/2024 7:12:02 PM; Lifecycle Status: Active; Minimum Order: 1; Number of Terminations: 2; Operating Temperature: -55°C ~ 155°C; Package / Case: 0201 (0603 Metric); Packaging: TapeAndReel; PartId: 3; Part Status: Active; Price: 0.02; Series: CRG, Neohm; Size / Dimension: 0.024" L x 0.012" W (0.60mm x 0.30mm); Supplier 1: DigiKey; Supplier Part Number 1: A129573CT-ND; Supplier Device Package: 0201; Tolerance: ±1%
U9 = LM25085: PFET Buck Controller
U10 = AP63205WU-7: 5V fixed step down Buck
U11 U12 = TLV74033PDQNR
U14 = INA185: INA185A2

## Sheet Half_Bridges.SchDoc
size B; DocumentNumber: 6; SheetNumber: 4; SheetTotal: 4
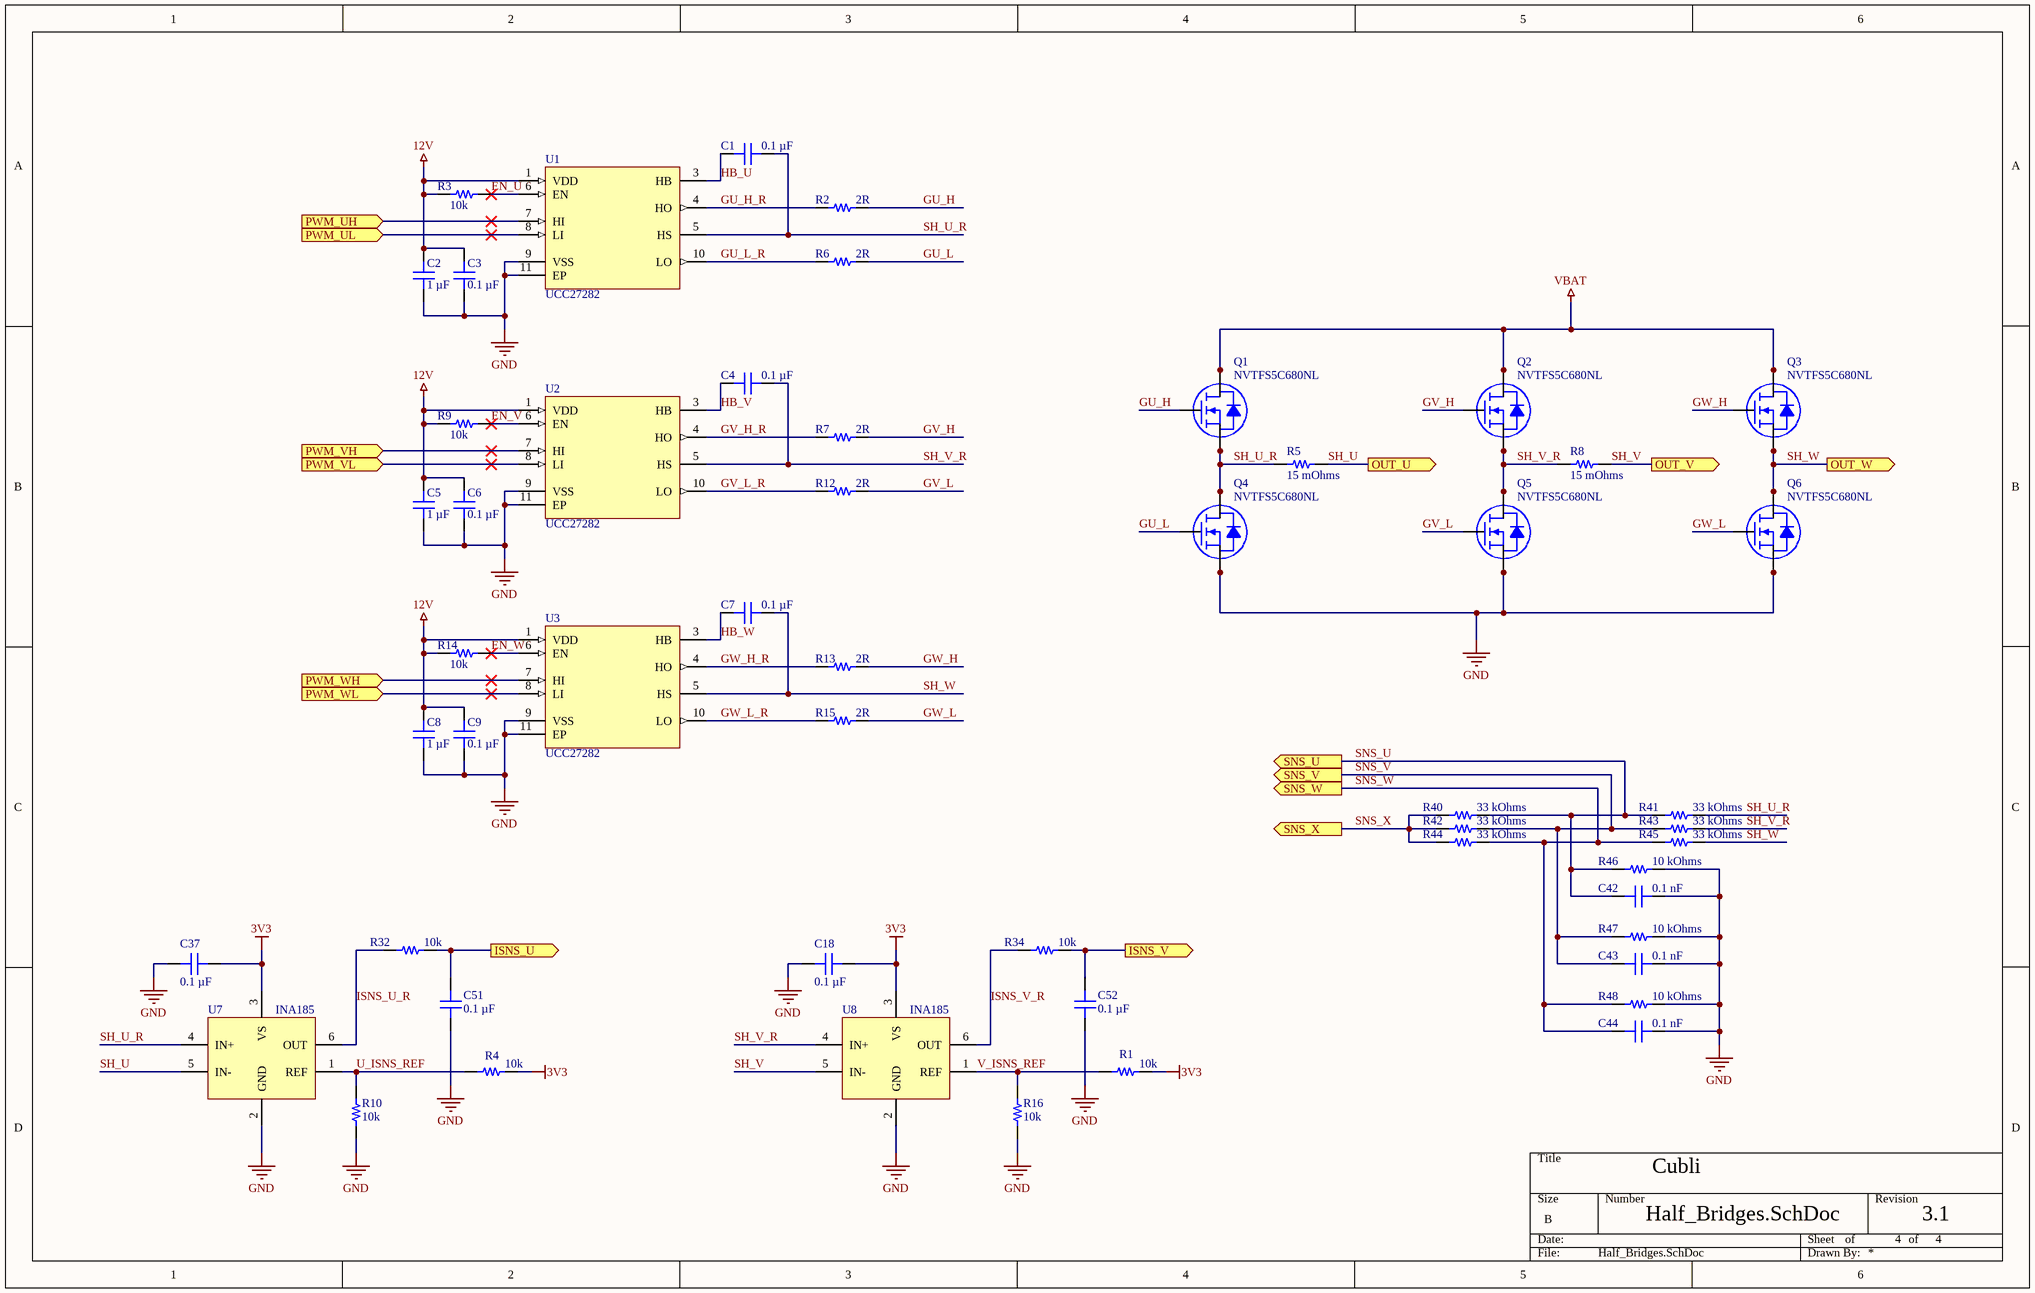
[diagram p3: Half_Bridges.SchDoc]

### Parts
C1  0.1 µF  [CAP 0402_1005]
C2  1 µF  [CAP 0402_1005]
C3  0.1 µF  [CAP 0402_1005]
C4  0.1 µF  [CAP 0402_1005]
C5  1 µF  [CAP 0402_1005]
C6  0.1 µF  [CAP 0402_1005]
C7  0.1 µF  [CAP 0402_1005]
C8  1 µF  [CAP 0402_1005]
C9  0.1 µF  [CAP 0402_1005]
C18  0.1 µF  [CAP 0402_1005]
C37  0.1 µF  [CAP 0402_1005]
C42  0.1 nF  [CAP 0402_1005]
C43  0.1 nF  [CAP 0402_1005]
C44  0.1 nF  [CAP 0402_1005]
C51  0.1 µF  [CAP 0402_1005]
C52  0.1 µF  [CAP 0402_1005]
Q1  NVTFS5C680NL  [NVTFS015N04CTAG]
Q2  NVTFS5C680NL  [NVTFS015N04CTAG]
Q3  NVTFS5C680NL  [NVTFS015N04CTAG]
Q4  NVTFS5C680NL  [NVTFS015N04CTAG]
Q5  NVTFS5C680NL  [NVTFS015N04CTAG]
Q6  NVTFS5C680NL  [NVTFS015N04CTAG]
R1  10k  [RES 0402_1005]
R2  2R  [RES 0402_1005]
R3  10k  [RES 0402_1005]
R4  10k  [RES 0402_1005]
R5  15 mOhms  [RES 1206_3216]
R6  2R  [RES 0402_1005]
R7  2R  [RES 0402_1005]
R8  15 mOhms  [RES 1206_3216]
R9  10k  [RES 0402_1005]
R10  10k  [RES 0402_1005]
R12  2R  [RES 0402_1005]
R13  2R  [RES 0402_1005]
R14  10k  [RES 0402_1005]
R15  2R  [RES 0402_1005]
R16  10k  [RES 0402_1005]
R32  10k  [RES 0402_1005]
R34  10k  [RES 0402_1005]
R40  33 kOhms  [RES 0402_1005]
R41  33 kOhms  [RES 0402_1005]
R42  33 kOhms  [RES 0402_1005]
R43  33 kOhms  [RES 0402_1005]
R44  33 kOhms  [RES 0402_1005]
R45  33 kOhms  [RES 0402_1005]
R46  10 kOhms  [RES 0402_1005]
R47  10 kOhms  [RES 0402_1005]
R48  10 kOhms  [RES 0402_1005]
U1  UCC27282  [VSON-10]
U2  UCC27282  [VSON-10]
U3  UCC27282  [VSON-10]
U7  INA185  [TI SC70-6 DCK]
U8  INA185  [TI SC70-6 DCK]

### Ports
ISNS_U (out), ISNS_V (out), OUT_U (out), OUT_V (out), OUT_W (out), PWM_UH (in), PWM_UL (in), PWM_VH (in), PWM_VL (in), PWM_WH (in), PWM_WL (in), SNS_U (out), SNS_V (out), SNS_W (out), SNS_X (out)

### Nets
3V3: C18.1 C37.1 R1.2 R4.2 U7.3(VS) U8.3(VS)
12V: C2.1 C3.1 C5.1 C6.1 C8.1 C9.1 R3.2 R9.2 R14.2 U1.1(VDD) U2.1(VDD) U3.1(VDD)
GND: C2.2 C3.2 C5.2 C6.2 C8.2 C9.2 C18.2 C37.2 C42.1 C43.1 C44.1 C51.2 C52.2 Q4.1(S) Q4.2(S) Q4.3(S) Q5.1(S) Q5.2(S) Q5.3(S) Q6.1(S) Q6.2(S) Q6.3(S) R10.1 R16.1 R46.1 R47.1 R48.1 U1.9(VSS) U1.11(EP) U2.9(VSS) U2.11(EP) U3.9(VSS) U3.11(EP) U7.2(GND) U8.2(GND)
VBAT: Q1.5(D) Q1.6(D) Q1.7(D) Q1.8(D) Q2.5(D) Q2.6(D) Q2.7(D) Q2.8(D) Q3.5(D) Q3.6(D) Q3.7(D) Q3.8(D)
EN_U: R3.1 U1.6(EN)
EN_V: R9.1 U2.6(EN)
EN_W: R14.1 U3.6(EN)
GU_H: Q1.4(G) R2.1
GU_H_R: R2.2 U1.4(HO)
GU_L: Q4.4(G) R6.1
GU_L_R: R6.2 U1.10(LO)
GV_H: Q2.4(G) R7.1
GV_H_R: R7.2 U2.4(HO)
GV_L: Q5.4(G) R12.1
GV_L_R: R12.2 U2.10(LO)
GW_H: Q3.4(G) R13.1
GW_H_R: R13.2 U3.4(HO)
GW_L: Q6.4(G) R15.1
GW_L_R: R15.2 U3.10(LO)
HB_U: C1.2 U1.3(HB)
HB_V: C4.2 U2.3(HB)
HB_W: C7.2 U3.3(HB)
ISNS_U: C51.1 R32.2 ; port ISNS_U
ISNS_U_R: R32.1 U7.6(OUT)
ISNS_V: C52.1 R34.2 ; port ISNS_V
ISNS_V_R: R34.1 U8.6(OUT)
PWM_UH: U1.7(HI) ; port PWM_UH
PWM_UL: U1.8(LI) ; port PWM_UL
PWM_VH: U2.7(HI) ; port PWM_VH
PWM_VL: U2.8(LI) ; port PWM_VL
PWM_WH: U3.7(HI) ; port PWM_WH
PWM_WL: U3.8(LI) ; port PWM_WL
SH_U: R5.2 U7.5(IN-) ; port OUT_U  [project net OUT_U]
SH_U_R: C1.1 Q1.1(S) Q1.2(S) Q1.3(S) Q4.5(D) Q4.6(D) Q4.7(D) Q4.8(D) R5.1 R41.2 U1.5(HS) U7.4(IN+)
SH_V: R8.2 U8.5(IN-) ; port OUT_V  [project net OUT_V]
SH_V_R: C4.1 Q2.1(S) Q2.2(S) Q2.3(S) Q5.5(D) Q5.6(D) Q5.7(D) Q5.8(D) R8.1 R43.2 U2.5(HS) U8.4(IN+)
SH_W: C7.1 Q3.1(S) Q3.2(S) Q3.3(S) Q6.5(D) Q6.6(D) Q6.7(D) Q6.8(D) R45.2 U3.5(HS) ; port OUT_W  [project net OUT_W]
SNS_U: C42.2 R40.2 R41.1 R46.2 ; port SNS_U
SNS_V: C43.2 R42.2 R43.1 R47.2 ; port SNS_V
SNS_W: C44.2 R44.2 R45.1 R48.2 ; port SNS_W
SNS_X: R40.1 R42.1 R44.1 ; port SNS_X
U_ISNS_REF: R4.1 R10.2 U7.1(REF)
V_ISNS_REF: R1.1 R16.2 U8.1(REF)

### Notes on the sheet
- of

### Library data of the parts
C1 C3 C4 C6 C7 C9 C18 C37 C51 C52 = C0402C104K4RACAUTO: as C16 on sheet Top; Part Number: C0402C104K4RACAUTO; Value: 0.1 µF; Applications: Automotive, Bypass, Decoupling; Capacitance: 0.1 µF; componentlink1description: Datasheet; componentlink1url: https://api.kemet.com/component-edge/download/specsheet/C0402C104K4RACAUTO.pdf; componentlink2description: DigiKey Link; componentlink2url: https://www.digikey.com/en/products/detail/kemet/C0402C104K4RACAUTO/3314827; Device Package: 0402 (1005 Metric); lastupdated: 8/14/2022 9:05:51 PM; Lifecycle Status: Active; Minimum Order: 1; Mounting Type: Surface Mount, MLCC; Operating Temperature: -55°C ~ 125°C; Package / Case: 0402 (1005 Metric); packaging: TapeAndReel; partid: 3024; Part Status: Active; price: 0.01; Ratings: AEC-Q200; series: SMD Auto X7R; Size / Dimension: 0.039" L x 0.020" W (1.00mm x 0.50mm); Supplier 1: DigiKey; Supplier Part Number 1: 399-6828-1-ND; Temperature Coefficient: X7R; Thickness (Max): 0.022" (0.55mm); Voltage - Rated: 16V
C2 C5 C8 C42-C44 = C0402C104K4RACAUTO: as C19 on sheet Power; Part Number: C0402C104K4RACAUTO; Applications: Automotive, Bypass, Decoupling; componentlink1description: Datasheet; componentlink1url: https://api.kemet.com/component-edge/download/specsheet/C0402C104K4RACAUTO.pdf; componentlink2description: DigiKey Link; componentlink2url: https://www.digikey.com/en/products/detail/kemet/C0402C104K4RACAUTO/3314827; Device Package: 0402 (1005 Metric); lastupdated: 8/14/2022 9:05:51 PM; Lifecycle Status: Active; Minimum Order: 1; Mounting Type: Surface Mount, MLCC; Operating Temperature: -55°C ~ 125°C; Package / Case: 0402 (1005 Metric); packaging: TapeAndReel; partid: 3024; Part Status: Active; price: 0.01; Ratings: AEC-Q200; series: SMD Auto X7R; Size / Dimension: 0.039" L x 0.020" W (1.00mm x 0.50mm); Supplier 1: DigiKey; Supplier Part Number 1: 399-6828-1-ND; Temperature Coefficient: X7R; Thickness (Max): 0.022" (0.55mm); Voltage - Rated: 16V
  C2 C5 C8: Value: 1 µF
  C42-C44: Value: 0.1 nF
Q1-Q6 = NVTFS5C680NL: N-FET
R1-R4 R6 R7 R9 R10 R12-R16 R32 R34 R40-R48 = RK73H1ETTP1432F: as R27 on sheet Top; Part Number: RK73H1ETTP1432F; ComponentLink1Description: Datasheet; ComponentLink1URL: http://www.koaspeer.com/catimages/Products/RK73H/RK73H.pdf; ComponentLink2Description: DigiKey Link; ComponentLink2URL: https://www.digikey.com/en/products/detail/koa-speer-electronics-inc/RK73H1ETTP1432F/9844351; Composition: Thick Film; Device Package: 0402 (1005 Metric); Features: Automotive AEC-Q200, Moisture Resistant; Height - Seated (Max): 0.016" (0.40mm); LastUpdated: 8/14/2022 9:23:49 PM; Lifecycle Status: Active; Minimum Order: 1; Number of Terminations: 2; Operating Temperature: -55°C ~ 155°C; Package / Case: 0402 (1005 Metric); Packaging: CutTape; PartId: 10193; Part Status: Active; Price: 0.01; Ratings: AEC-Q200; Series: RK73H; Size / Dimension: 0.039" L x 0.020" W (1.00mm x 0.50mm); Supplier 1: DigiKey; Supplier Part Number 1: 2019-RK73H1ETTP1432FCT-ND; Supplier Device Package: 0402; Tolerance: ±1%
  R1 R3 R4 R9 R10 R14 R16 R32 R34: Value: 10k
  R2 R6 R7 R12 R13 R15: Value: 2R
  R40-R45: Value: 33 kOhms
  R46-R48: Value: 10 kOhms
R5 R8 = KRL1632E-M-R039-F-T5: RES 0.039 OHM 1% 3/4W 1206; Manufacturer: Susumu; Power (Watts): 0.75W, 3/4W; Resistance: 39 mOhms; Temperature Coefficient: ±50ppm/°C; Value: 39 mOhms; Part Number: KRL1632E-M-R039-F-T5; ComponentLink1Description: Datasheet; ComponentLink1URL: http://www.susumu.co.jp/common/pdf/n_catalog_partition09_en.pdf; ComponentLink2Description: DigiKey Link; ComponentLink2URL: https://www.digikey.com/en/products/detail/susumu/KRL1632E-M-R039-F-T5/3738003; Composition: Metal Foil; Device Package: 1206 (3216 Metric); Features: Automotive AEC-Q200, Current Sense; Height - Seated (Max): 0.028" (0.70mm); LastUpdated: 2/9/2024 8:54:46 PM; Lifecycle Status: Active; Minimum Order: 1; Number of Terminations: 2; Operating Temperature: -55°C ~ 155°C; Package / Case: 1206 (3216 Metric); Packaging: TapeAndReel; PartId: 26838; Part Status: Active; Price: 0.09; Ratings: AEC-Q200; Series: KRL; Size / Dimension: 0.126" L x 0.063" W (3.20mm x 1.60mm); Supplier 1: DigiKey; Supplier Part Number 1: 408-1577-1-ND; Supplier Device Package: 1206; Tolerance: ±1%
U1-U3 = UCC27282DRCR: 3-A, 120-V half bridge gate driver with 5-V UVLO, interlock and enable 10-VSON -40 to 125; MF: Texas Instruments; Texas_Instruments-Purchase-URL: https://snapeda.com/shop?store=Texas+Instruments&id=3625400; Price: None; Availability: Warning; Package: VSON-10 Texas Instruments; SnapEDA_Link: https://www.snapeda.com/parts/UCC27282DRCR/Texas%20Instruments/view-part/3625400/?ref=snap; DigiKey-Purchase-URL: https://snapeda.com/shop?store=DigiKey&id=3625400; MP: UCC27282DRCR; Value: *
U7 U8 = INA185: INA185A2

## Nets that join several sheets
3V3: Top (C17.2 U4.8), Power (C35.2 U12.1), Half_Bridges (6 pins)
3V3_MCU: Top (5 pins), PIC32MK (8 pins), Power (C33.2 C50.1 U11.1 U14.3)
5V: Top (J5.1), Power (10 pins)
12V: Top (R28.2), Power (7 pins), Half_Bridges (12 pins)
GND: Top (20 pins), PIC32MK (12 pins), Power (32 pins), Half_Bridges (35 pins)
VBAT: Top (R27.2), Power (21 pins), Half_Bridges (12 pins)
ISNS_V: PIC32MK (U6.7), Half_Bridges (C52.1 R34.2)
PWM_UH: PIC32MK (U6.1), Half_Bridges (U1.7)
PWM_UL: PIC32MK (U6.2), Half_Bridges (U1.8)
PWM_VH: PIC32MK (U6.29), Half_Bridges (U2.7)
PWM_VL: PIC32MK (U6.30), Half_Bridges (U2.8)
PWM_WH: PIC32MK (U6.27), Half_Bridges (U3.7)
PWM_WL: PIC32MK (U6.28), Half_Bridges (U3.8)
SCL: Top (U4.2 U5.2), PIC32MK (U6.23)
SDA: Top (U4.1 U5.1), PIC32MK (U6.22)
SNS_U: Top (U13.8), PIC32MK (U6.8), Half_Bridges (C42.2 R40.2 R41.1 R46.2)
SNS_V: Top (U13.6), Half_Bridges (C43.2 R42.2 R43.1 R47.2)
SNS_W: Top (U13.4), PIC32MK (U6.6), Half_Bridges (C44.2 R44.2 R45.1 R48.2)
SNS_X: Top (U13.2 U13.5 U13.7), Half_Bridges (R40.1 R42.1 R44.1)

## Assembly variants
Main: not fitted R1